# Altium project EE534 - Development Kit Basic.PrjPcb
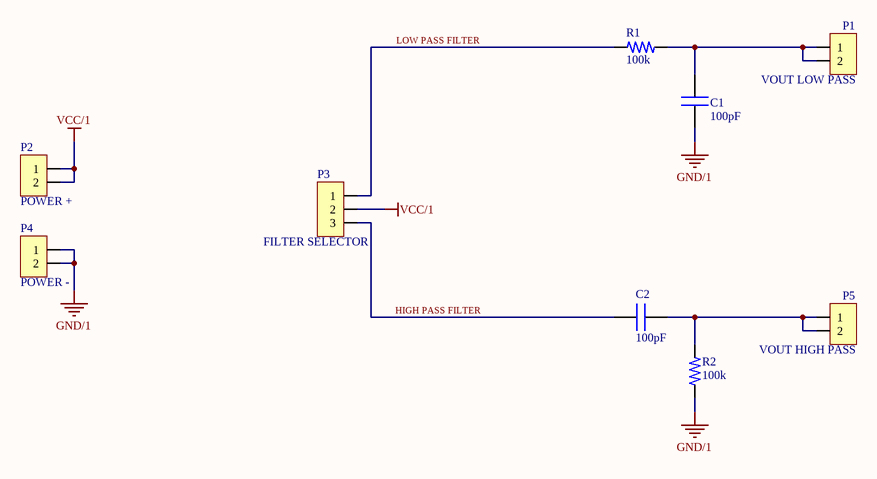
[diagram p0: Experiment 1 0.0.0.SchDoc]
5 sheets, 89 parts. Net scope: global (net labels, ports and power ports of the same name join across sheets).
Board file: All-in-One 0.0.0.PcbDoc
Sheets:
  Experiment 1 0.0.0.SchDoc
  Experiment 2 0.0.0.SchDoc
  Experiment 3 0.0.0.SchDoc
  Experiment 4 0.0.0.SchDoc
  Experiment 5 0.0.0.SchDoc

## Sheet Experiment 1 0.0.0.SchDoc
size A4; Organization: Altium Limited; Address1: L3, 12a Rodborough Rd; Address2: Frenchs Forest; Address3: NSW; Address4: Australia 2086; DocumentNumber: 1; SheetNumber: 1; SheetTotal: 5

### Parts
C1  100pF  [CAP-H5]
C2  100pF  [CAP-H5]
P1  VOUT LOW PASS  [PINHD-1X02 ONCE]
P2  POWER +  [PINHD-1X02 ONCE]
P3  FILTER SELECTOR  [PINHD-1X03]
P4  POWER -  [PINHD-1X02 ONCE]
P5  VOUT HIGH PASS  [PINHD-1X02 ONCE]
R1  100k  [R Axial 0.25]
R2  100k  [R Axial 0.25]

### Nets
GND/1: C1.2 P4.1 P4.2 R2.1
VCC/1: P2.1 P2.2 P3.2
NetC1_1: C1.1 P1.1 P1.2 R1.2
NetC2_1: C2.1 P3.3
NetC2_2: C2.2 P5.1 P5.2 R2.2
NetP3_1: P3.1 R1.1

### Notes on the sheet
- LOW PASS FILTER
- HIGH PASS FILTER
- Elivelton Santos
- https://github.com/eliveltonpsantos
- Project:
- Sheet:
- Date:
- Time:
- Sheet
- of
- File:

### Library data of the parts
C1 C2 = K101K10X7RF5UH5: CAP CER 100PF 50V X7R RADIAL; Manufacturer: Vishay BC Components; Tolerance: ±10%; Category: Capacitors; Manufacturer Part Number: K101K10X7RF5UH5; Package / Case: 0.142" L x 0.091" W (3.60mm x 2.30mm); Capacitance: 100pF; Voltage: 50V; Supplier 1: Digi-Key; Supplier Part Number 1: BC2657CT-ND
P1 P2 P4 P5 = PIN HEADER 1X02 ONCE: CONN HEADER 2POS .100" STR TIN; Manufacturer: Molex, LLC; Manufacturer Part Number: 0901200122; Category: Connectors; Supplier 1: Digi-Key; Supplier Part Number 1: WM8072-ND
P3 = PIN HEADER 1X03: CONN HEADER 3POS .100" STR TIN; Manufacturer: Molex, LLC; Manufacturer Part Number: 0901200123; Category: Connectors; Supplier 1: Digi-Key; Supplier Part Number 1: WM8073-ND
R1 R2 = CFR-25JB-52-100K: RES 100K OHM 1/4W 5% AXIAL; Manufacturer: Yageo; Power (Watts): 0.25W, 1/4W; Resistance (Ohms): 10k; Category: Resistors; Manufacturer Part Number: CFR-25JB-52-100K; Package / Case: Axial; Tolerance: ±5%; Supplier 1: Digi-Key; Supplier Part Number 1: 100KQBK-ND

## Sheet Experiment 2 0.0.0.SchDoc
size A4; Organization: Altium Limited; Address1: L3, 12a Rodborough Rd; Address2: Frenchs Forest; Address3: NSW; Address4: Australia 2086; DocumentNumber: 2; SheetNumber: 2; SheetTotal: 5
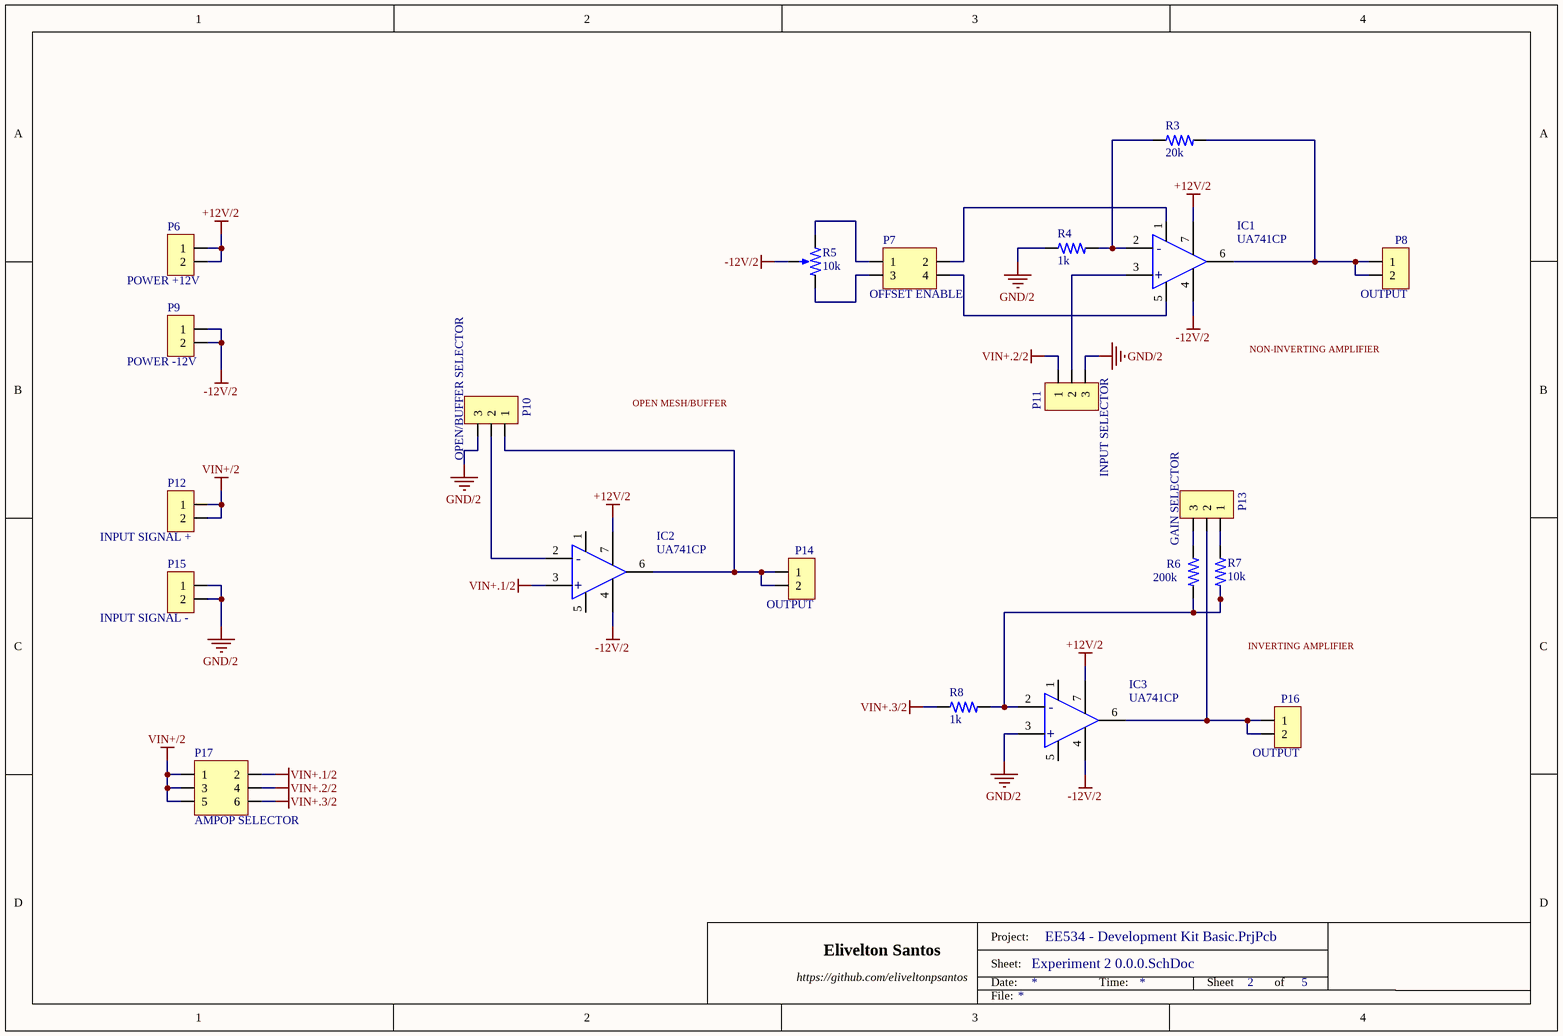
[diagram p1: Experiment 2 0.0.0.SchDoc]

### Parts
IC1  UA741CP  [DIP-8]
IC2  UA741CP  [DIP-8]
IC3  UA741CP  [DIP-8]
P6  POWER +12V  [PINHD-1X02 ONCE]
P7  OFFSET ENABLE  [PINHD-2X02]
P8  OUTPUT  [PINHD-1X02 ONCE]
P9  POWER -12V  [PINHD-1X02 ONCE]
P10  OPEN/BUFFER SELECTOR  [PINHD-1X03]
P11  INPUT SELECTOR  [PINHD-1X03]
P12  INPUT SIGNAL +  [PINHD-1X02 ONCE]
P13  GAIN SELECTOR  [PINHD-1X03]
P14  OUTPUT  [PINHD-1X02 ONCE]
P15  INPUT SIGNAL -  [PINHD-1X02 ONCE]
P16  OUTPUT  [PINHD-1X02 ONCE]
P17  AMPOP SELECTOR  [PINHD-2X03]
R3  20k  [R Axial 0.25]
R4  1k  [R Axial 0.25]
R5  10k  [PV36W]
R6  200k  [R Axial 0.25]
R7  10k  [R Axial 0.25]
R8  1k  [R Axial 0.25]

### Nets
+12V/2: IC1.7(VCC+) IC2.7(VCC+) IC3.7(VCC+) P6.1 P6.2
-12V/2: IC1.4(VCC-) IC2.4(VCC-) IC3.4(VCC-) P9.1 P9.2 R5.2
GND/2: IC3.3(+) P10.3 P11.3 P15.1 P15.2 R4.1
VIN+.1/2: IC2.3(+) P17.2
VIN+.2/2: P11.1 P17.4
VIN+.3/2: P17.6 R8.1
VIN+/2: P12.1 P12.2 P17.1 P17.3 P17.5
NetIC1_1: IC1.1(OFFSET1) P7.2
NetIC1_2: IC1.2(-) R3.1 R4.2
NetIC1_3: IC1.3(+) P11.2
NetIC1_5: IC1.5(OFFSET2) P7.4
NetIC1_6: IC1.6(OUTPUT) P8.1 P8.2 R3.2
NetIC2_2: IC2.2(-) P10.2
NetIC2_6: IC2.6(OUTPUT) P10.1 P14.1 P14.2
NetIC3_2: IC3.2(-) R6.1 R7.2 R8.2
NetIC3_6: IC3.6(OUTPUT) P13.2 P16.1 P16.2
NetP7_1: P7.1 R5.1
NetP7_3: P7.3 R5.3
NetP13_1: P13.1 R7.1
NetP13_3: P13.3 R6.2

Not connected (* = marked no-connect by the designer): IC2 1(OFFSET1) 5(OFFSET2); IC3 1(OFFSET1) 5(OFFSET2)

### Notes on the sheet
- NON-INVERTING AMPLIFIER
- OPEN MESH/BUFFER
- INVERTING AMPLIFIER
- Elivelton Santos
- https://github.com/eliveltonpsantos
- Project:
- Sheet:
- Date:
- Time:
- Sheet
- of
- File:

### Library data of the parts
IC1-IC3 = UA741CP: IC OPAMP GP 1MHZ 8DIP; Manufacturer: Texas Instruments; Category: ICs; Manufacturer Part Number: UA741CP; Package / Case: 8-PDIP; Supplier 1: Digi-Key; Supplier Part Number 1: 296-11107-5-ND
P6 P8 P9 P12 P14-P16 = PIN HEADER 1X02 ONCE: as P1 on sheet Experiment 1 0.0.0; Category: Connectors; Supplier 1: Digi-Key; Supplier Part Number 1: WM8072-ND
P7 = PIN HEADER 2X02: CONN HEADER 4POS .100" STR TIN; Manufacturer: Molex, LLC; Manufacturer Part Number: 0901310122; Category: Connectors; Supplier 1: Digi-Key; Supplier Part Number 1: WM8120-ND
P10 P11 P13 = PIN HEADER 1X03: as P3 on sheet Experiment 1 0.0.0; Category: Connectors; Supplier 1: Digi-Key; Supplier Part Number 1: WM8073-ND
P17 = PIN HEADER 2X03: CONN HEADER 6POS .100" STR TIN; Manufacturer: Molex, LLC; Manufacturer Part Number: 0901310123; Category: Connectors; Supplier 1: Digi-Key; Supplier Part Number 1: WM8121-ND
R3 = CFR-25JB-52-20K: RES 20K OHM 1/4W 5% AXIAL; Manufacturer: Yageo; Power (Watts): 0.25W, 1/4W; Category: Resistors; Manufacturer Part Number: CFR-25JB-52-20K; Package / Case: Axial; Resistance (Ohms): 20k; Tolerance: ±5%; Supplier 1: Digi-Key; Supplier Part Number 1: 20KQBK-ND
R4 R8 = CFR-25JB-52-1K: RES 1K OHM 1/4W 5% AXIAL; Manufacturer: Yageo; Power (Watts): 0.25W, 1/4W; Category: Resistors; Manufacturer Part Number: CFR-25JB-52-1K; Package / Case: Axial; Resistance (Ohms): 1k; Tolerance: ±5%; Supplier 1: Digi-Key; Supplier Part Number 1: 1.0KQBK-ND
R5 = PV36W103C01B00: TRIMMER 10K OHM 0.5W TH; Manufacturer: Bourns Inc.; Power (Watts): 0.5W, 1/2W; Tolerance: ±10%; Number of Turns: 25; Adjustment Type: Top Adjustment; Category: Resistors; Manufacturer Part Number: PV36W103C01B00; Resistance (Ohms): 10k; Supplier 1: Digi-Key; Supplier Part Number 1: 490-2875-ND
R6 = CFR-25JB-52-200K: RES 200K OHM 1/4W 5% AXIAL; Manufacturer: Yageo; Power (Watts): 0.25W, 1/4W; Category: Resistors; Manufacturer Part Number: CFR-25JB-52-200K; Package / Case: Axial; Resistance (Ohms): 200k; Tolerance: ±5%; Supplier 1: Digi-Key; Supplier Part Number 1: 200KQBK-ND
R7 = CFR-25JB-52-10K: RES 10K OHM 1/4W 5% AXIAL; Manufacturer: Yageo; Power (Watts): 0.25W, 1/4W; Category: Resistors; Manufacturer Part Number: CFR-25JB-52-10K; Package / Case: Axial; Resistance (Ohms): 10k; Tolerance: ±5%; Supplier 1: Digi-Key; Supplier Part Number 1: 10KQBK-ND

## Sheet Experiment 3 0.0.0.SchDoc
size A4; Organization: Altium Limited; Address1: L3, 12a Rodborough Rd; Address2: Frenchs Forest; Address3: NSW; Address4: Australia 2086; DocumentNumber: 3; SheetNumber: 3; SheetTotal: 5
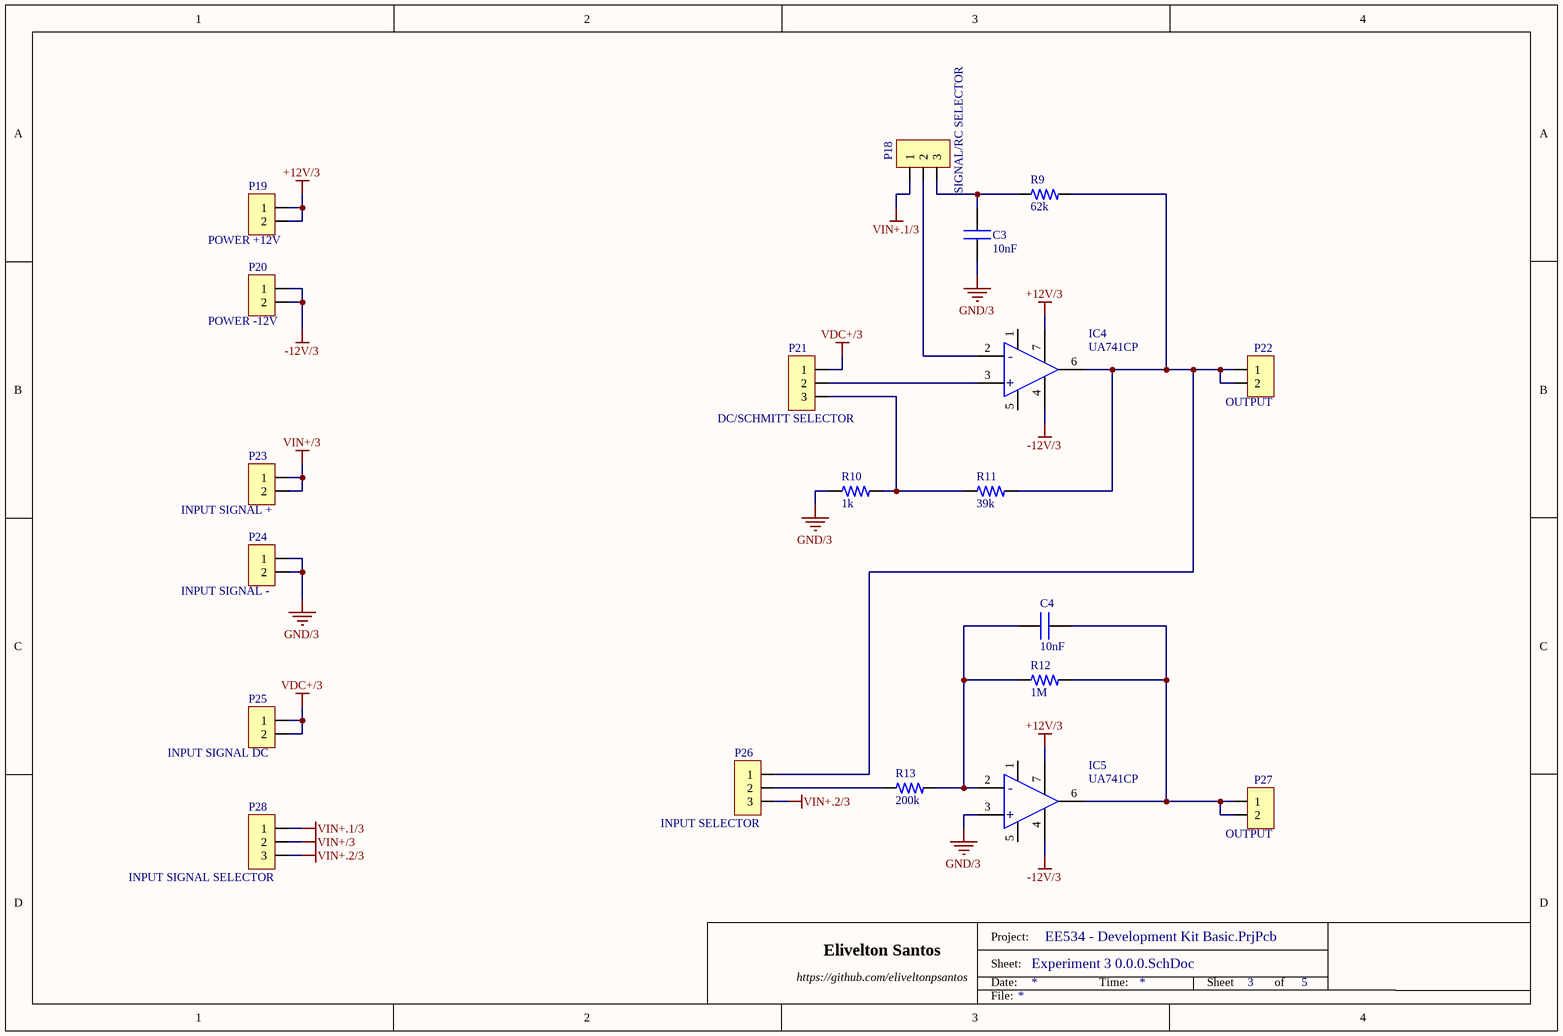
[diagram p2: Experiment 3 0.0.0.SchDoc]

### Parts
C3  10nF  [CAP-H5]
C4  10nF  [CAP-H5]
IC4  UA741CP  [DIP-8]
IC5  UA741CP  [DIP-8]
P18  SIGNAL/RC SELECTOR  [PINHD-1X03]
P19  POWER +12V  [PINHD-1X02 ONCE]
P20  POWER -12V  [PINHD-1X02 ONCE]
P21  DC/SCHMITT SELECTOR  [PINHD-1X03]
P22  OUTPUT  [PINHD-1X02 ONCE]
P23  INPUT SIGNAL +  [PINHD-1X02 ONCE]
P24  INPUT SIGNAL -  [PINHD-1X02 ONCE]
P25  INPUT SIGNAL DC  [PINHD-1X02 ONCE]
P26  INPUT SELECTOR  [PINHD-1X03]
P27  OUTPUT  [PINHD-1X02 ONCE]
P28  INPUT SIGNAL SELECTOR  [PINHD-1X03]
R9  62k  [R Axial 0.25]
R10  1k  [R Axial 0.25]
R11  39k  [R Axial 0.25]
R12  1M  [R Axial 0.25]
R13  200k  [R Axial 0.25]

### Nets
+12V/3: IC4.7(VCC+) IC5.7(VCC+) P19.1 P19.2
-12V/3: IC4.4(VCC-) IC5.4(VCC-) P20.1 P20.2
GND/3: C3.1 IC5.3(+) P24.1 P24.2 R10.1
VDC+/3: P21.1 P25.1 P25.2
VIN+.1/3: P18.1 P28.1
VIN+.2/3: P26.3 P28.3
VIN+/3: P23.1 P23.2 P28.2
NetC3_2: C3.2 P18.3 R9.1
NetC4_1: C4.1 IC5.6(OUTPUT) P27.1 P27.2 R12.2
NetC4_2: C4.2 IC5.2(-) R12.1 R13.2
NetIC4_2: IC4.2(-) P18.2
NetIC4_3: IC4.3(+) P21.2
NetIC4_6: IC4.6(OUTPUT) P22.1 P22.2 P26.1 R9.2 R11.2
NetP21_3: P21.3 R10.2 R11.1
NetP26_2: P26.2 R13.1

Not connected (* = marked no-connect by the designer): IC4 1(OFFSET1) 5(OFFSET2); IC5 1(OFFSET1) 5(OFFSET2)

### Notes on the sheet
- Elivelton Santos
- https://github.com/eliveltonpsantos
- Project:
- Sheet:
- Date:
- Time:
- Sheet
- of
- File:

### Library data of the parts
C3 C4 = K103K10X7RF5UH5: CAP CER 10000PF 50V X7R RADIAL; Manufacturer: Vishay BC Components; Manufacturer Part Number: K101K10X7RF5UH5; Tolerance: ±10%; Category: Capacitors; Package / Case: 0.142" L x 0.091" W (3.60mm x 2.30mm); Capacitance: 10nF; Voltage: 50V; Supplier 1: Digi-Key; Supplier Part Number 1: BC2662CT-ND
IC4 IC5 = UA741CP: as IC1 on sheet Experiment 2 0.0.0; Category: ICs; Manufacturer Part Number: UA741CP; Package / Case: 8-PDIP; Supplier 1: Digi-Key; Supplier Part Number 1: 296-11107-5-ND
P18 P21 P26 P28 = PIN HEADER 1X03: as P3 on sheet Experiment 1 0.0.0; Category: Connectors; Supplier 1: Digi-Key; Supplier Part Number 1: WM8073-ND
P19 P20 P22-P25 P27 = PIN HEADER 1X02 ONCE: as P1 on sheet Experiment 1 0.0.0; Category: Connectors; Supplier 1: Digi-Key; Supplier Part Number 1: WM8072-ND
R9 = CFR-25JB-52-62K: RES 62K OHM 1/4W 5% AXIAL; Manufacturer: Yageo; Power (Watts): 0.25W, 1/4W; Category: Resistors; Manufacturer Part Number: CFR-25JB-52-62K; Package / Case: Axial; Resistance (Ohms): 62k; Tolerance: ±5%; Supplier 1: Digi-Key; Supplier Part Number 1: 62KQBK-ND
R10 = CFR-25JB-52-1K: as R4 on sheet Experiment 2 0.0.0; Category: Resistors; Manufacturer Part Number: CFR-25JB-52-1K; Package / Case: Axial; Resistance (Ohms): 1k; Tolerance: ±5%; Supplier 1: Digi-Key; Supplier Part Number 1: 1.0KQBK-ND
R11 = CFR-25JB-52-39K: RES 39K OHM 1/4W 5% AXIAL; Manufacturer: Yageo; Power (Watts): 0.25W, 1/4W; Category: Resistors; Manufacturer Part Number: CFR-25JB-52-39K; Package / Case: Axial; Resistance (Ohms): 39k; Tolerance: ±5%; Supplier 1: Digi-Key; Supplier Part Number 1: 39KQBK-ND
R12 = CFR-25JB-52-1M: RES 1M OHM 1/4W 5% AXIAL; Manufacturer: Yageo; Power (Watts): 0.25W, 1/4W; Category: Resistors; Manufacturer Part Number: CFR-25JB-52-1M; Package / Case: Axial; Resistance (Ohms): 1M; Tolerance: ±5%; Supplier 1: Digi-Key; Supplier Part Number 1: 1.0MQBK-ND
R13 = CFR-25JB-52-200K: as R6 on sheet Experiment 2 0.0.0; Category: Resistors; Manufacturer Part Number: CFR-25JB-52-200K; Package / Case: Axial; Resistance (Ohms): 200k; Tolerance: ±5%; Supplier 1: Digi-Key; Supplier Part Number 1: 200KQBK-ND

## Sheet Experiment 4 0.0.0.SchDoc
size A4; Organization: Altium Limited; Address1: L3, 12a Rodborough Rd; Address2: Frenchs Forest; Address3: NSW; Address4: Australia 2086; DocumentNumber: 4; SheetNumber: 4; SheetTotal: 5
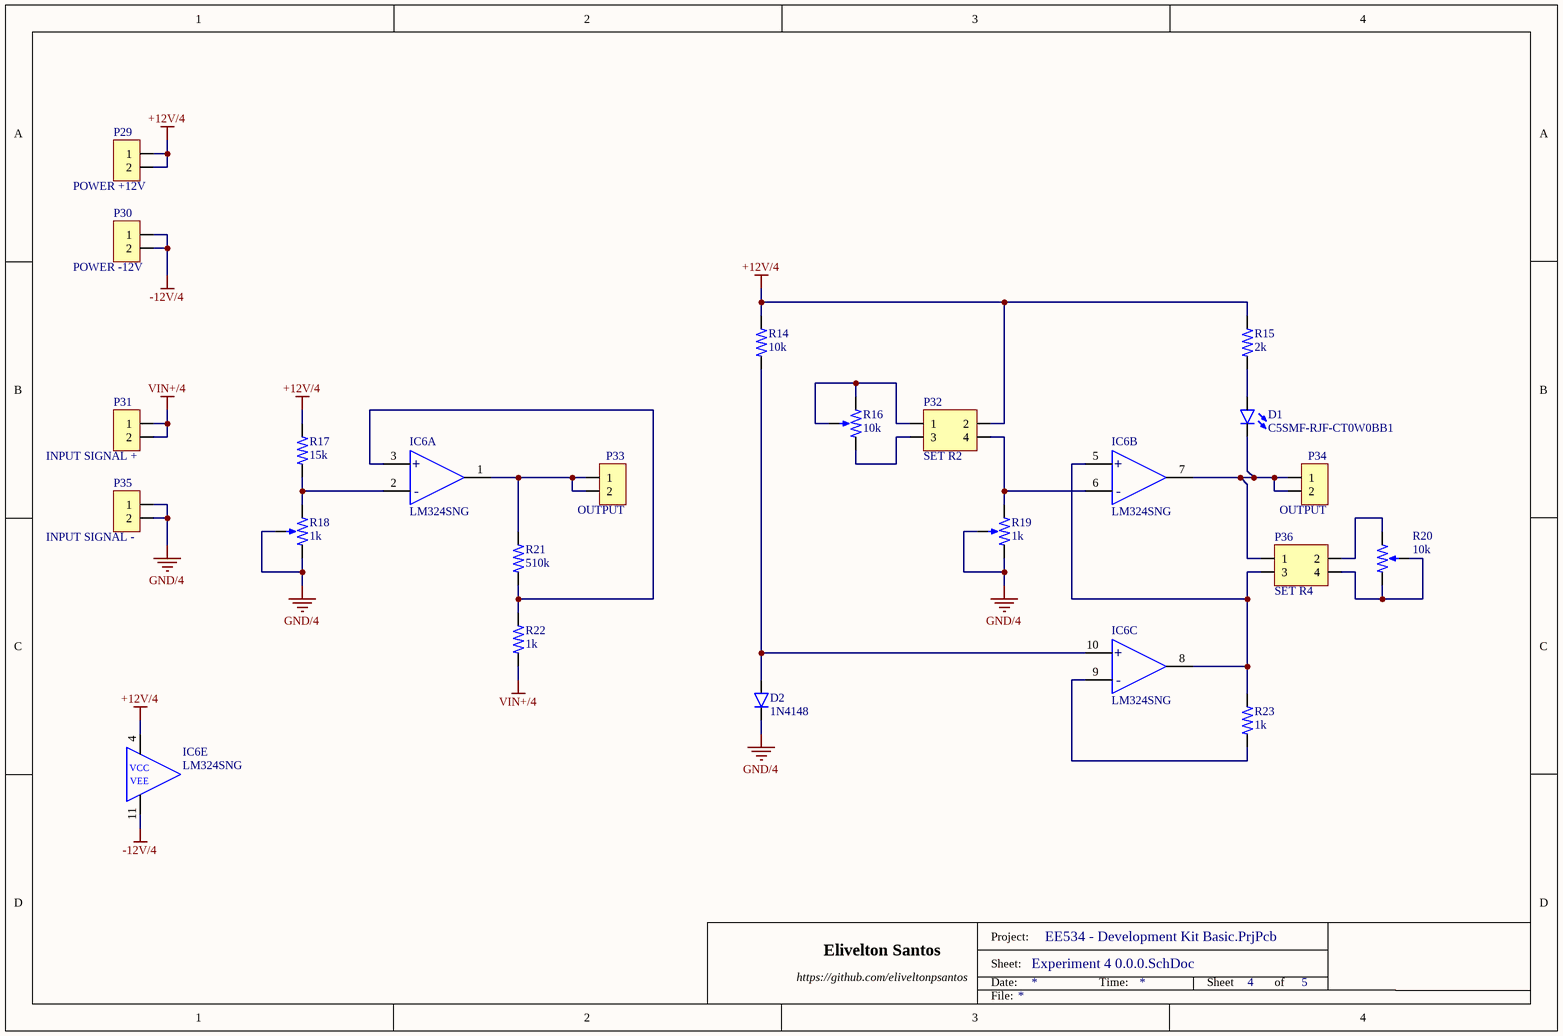
[diagram p3: Experiment 4 0.0.0.SchDoc]

### Parts
D1  C5SMF-RJF-CT0W0BB1  [LED-5MM]
D2  1N4148  [DO35-10]
IC6  LM324SNG  [DIP-14]  (parts A,B,C,E of 5)
P29  POWER +12V  [PINHD-1X02 ONCE]
P30  POWER -12V  [PINHD-1X02 ONCE]
P31  INPUT SIGNAL +  [PINHD-1X02 ONCE]
P32  SET R2  [PINHD-2X02]
P33  OUTPUT  [PINHD-1X02 ONCE]
P34  OUTPUT  [PINHD-1X02 ONCE]
P35  INPUT SIGNAL -  [PINHD-1X02 ONCE]
P36  SET R4  [PINHD-2X02]
R14  10k  [R Axial 0.25]
R15  2k  [R Axial 0.25]
R16  10k  [PV36W]
R17  15k  [R Axial 0.25]
R18  1k  [PV36W]
R19  1k  [PV36W]
R20  10k  [PV36W]
R21  510k  [R Axial 0.25]
R22  1k  [R Axial 0.25]
R23  1k  [R Axial 0.25]

### Nets
+12V/4: IC6.4(VCC) P29.1 P29.2 P32.2 R14.2 R15.2 R17.2
-12V/4: IC6.11(VEE) P30.1 P30.2
GND/4: D2.C(Cathode) P35.1 P35.2 R18.2 R18.3 R19.2 R19.3
VIN+/4: P31.1 P31.2 R22.1
NetD1_1: D1.1(Anode) R15.1
NetD1_2: D1.2(Cathode) IC6.7(OUTPUT_2) P34.1 P34.2 P36.1
NetD2_A: D2.A(Anode) IC6.10(INPUT_+_3) R14.1
NetIC6_1: IC6.1(OUTPUT_1) P33.1 P33.2 R21.2
NetIC6_2: IC6.2(INPUT_-_1) R17.1 R18.1
NetIC6_3: IC6.3(INPUT_+_1) R21.1 R22.2
NetIC6_5: IC6.5(INPUT_+_2) IC6.8(OUTPUT_3) P36.3 R23.2
NetIC6_6: IC6.6(INPUT_-_2) P32.4 R19.1
NetIC6_9: IC6.9(INPUT_-_3) R23.1
NetP32_1: P32.1 R16.1 R16.2
NetP32_3: P32.3 R16.3
NetP36_2: P36.2 R20.3
NetP36_4: P36.4 R20.1 R20.2

### Notes on the sheet
- Elivelton Santos
- https://github.com/eliveltonpsantos
- Project:
- Sheet:
- Date:
- Time:
- Sheet
- of
- File:
- (in symbol LM324SNG, part A) +; -
- (in symbol LM324SNG, part B) +; -
- (in symbol LM324SNG, part C) +; -

### Library data of the parts
D1 = C5SMF-RJF-CT0W0BB1: LED RED CLEAR 5MM OVAL T/H; Manufacturer: Cree Inc.; Category: Optoelectronics; Manufacturer Part Number: C5SMF-RJF-CT0W0BB1; Package / Case: 5mm Oval; Color: Red; Supplier 1: Digi-Key; Supplier Part Number 1: C5SMF-RJF-CT0W0BB1-ND
D2 = 1N4148: DIODE GEN PURP 100V 200MA DO35; Manufacturer: Fairchild Semiconductor; Category: Diodes; Manufacturer Part Number: 1N4148; Package / Case: DO-35; Reverse Voltage: 100V; Forward Current: 200mA; Supplier 1: Digi-Key; Supplier Part Number 1: 1N4148FS-ND
IC6 = LM324SNG: IC OP AMP 4CH 14DIP; Manufacturer: ON Semiconductor; Category: ICs; Manufacturer Part Number: LM324SNG; Package / Case: 14-PDIP; Supplier 1: Digi-Key; Supplier Part Number 1: LM324SNGOS-ND
P29-P31 P33-P35 = PIN HEADER 1X02 ONCE: as P1 on sheet Experiment 1 0.0.0; Category: Connectors; Supplier 1: Digi-Key; Supplier Part Number 1: WM8072-ND
P32 P36 = PIN HEADER 2X02: as P7 on sheet Experiment 2 0.0.0; Category: Connectors; Supplier 1: Digi-Key; Supplier Part Number 1: WM8120-ND
R14 = CFR-25JB-52-10K: as R7 on sheet Experiment 2 0.0.0; Category: Resistors; Manufacturer Part Number: CFR-25JB-52-10K; Package / Case: Axial; Resistance (Ohms): 10k; Tolerance: ±5%; Supplier 1: Digi-Key; Supplier Part Number 1: 10KQBK-ND
R15 = CFR-25JB-52-2K: RES 2K OHM 1/4W 5% AXIAL; Manufacturer: Yageo; Power (Watts): 0.25W, 1/4W; Category: Resistors; Manufacturer Part Number: CFR-25JB-52-2K; Package / Case: Axial; Resistance (Ohms): 2k; Tolerance: ±5%; Supplier 1: Digi-Key; Supplier Part Number 1: 2.0KQBK-ND
R16 R20 = PV36W103C01B00: as R5 on sheet Experiment 2 0.0.0; Category: Resistors; Manufacturer Part Number: PV36W103C01B00; Resistance (Ohms): 10k; Supplier 1: Digi-Key; Supplier Part Number 1: 490-2875-ND
R17 = CFR-25JB-52-15K: RES 15K OHM 1/4W 5% AXIAL; Manufacturer: Yageo; Power (Watts): 0.25W, 1/4W; Category: Resistors; Manufacturer Part Number: CFR-25JB-52-15K; Package / Case: Axial; Resistance (Ohms): 15k; Tolerance: ±5%; Supplier 1: Digi-Key; Supplier Part Number 1: 15KQBK-ND
R18 R19 = PV36W102C01B00: TRIMMER 1K OHM 0.5W TH; Manufacturer: Bourns Inc.; Power (Watts): 0.5W, 1/2W; Tolerance: ±10%; Number of Turns: 25; Adjustment Type: Top Adjustment; Category: Resistors; Manufacturer Part Number: PV36W102C01B00; Resistance (Ohms): 1k; Supplier 1: Digi-Key; Supplier Part Number 1: 490-2874-ND
R21 = CFR-25JB-52-510K: RES 510K OHM 1/4W 5% AXIAL; Manufacturer: Yageo; Power (Watts): 0.25W, 1/4W; Category: Resistors; Manufacturer Part Number: CFR-25JB-52-510K; Package / Case: Axial; Resistance (Ohms): 510k; Tolerance: ±5%; Supplier 1: Digi-Key; Supplier Part Number 1: 510KQBK-ND
R22 R23 = CFR-25JB-52-1K: as R4 on sheet Experiment 2 0.0.0; Category: Resistors; Manufacturer Part Number: CFR-25JB-52-1K; Package / Case: Axial; Resistance (Ohms): 1k; Tolerance: ±5%; Supplier 1: Digi-Key; Supplier Part Number 1: 1.0KQBK-ND

## Sheet Experiment 5 0.0.0.SchDoc
size A4; Organization: Altium Limited; Address1: L3, 12a Rodborough Rd; Address2: Frenchs Forest; Address3: NSW; Address4: Australia 2086; DocumentNumber: 5; SheetNumber: 5; SheetTotal: 5
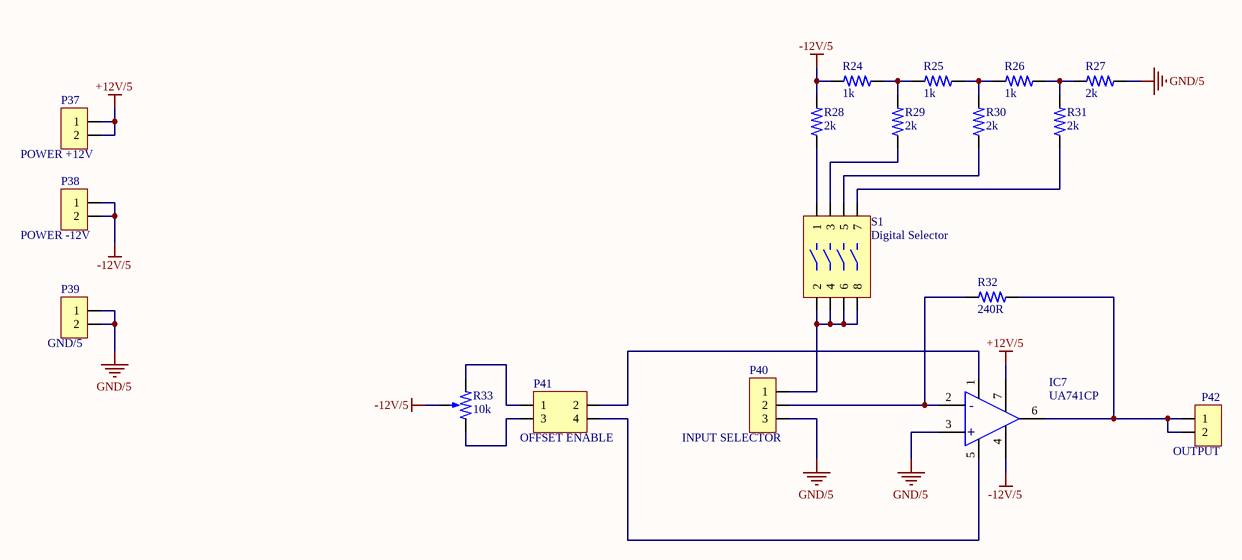
[diagram p4: Experiment 5 0.0.0.SchDoc]

### Parts
IC7  UA741CP  [DIP-8]
P37  POWER +12V  [PINHD-1X02 ONCE]
P38  POWER -12V  [PINHD-1X02 ONCE]
P39  GND/5  [PINHD-1X02 ONCE]
P40  INPUT SELECTOR  [PINHD-1X03]
P41  OFFSET ENABLE  [PINHD-2X02]
P42  OUTPUT  [PINHD-1X02 ONCE]
R24  1k  [R Axial 0.25]
R25  1k  [R Axial 0.25]
R26  1k  [R Axial 0.25]
R27  2k  [R Axial 0.25]
R28  2k  [R Axial 0.25]
R29  2k  [R Axial 0.25]
R30  2k  [R Axial 0.25]
R31  2k  [R Axial 0.25]
R32  240R  [R Axial 0.25]
R33  10k  [PV36W]
S1  Digital Selector  [DIP-206-4S]

### Nets
+12V/5: IC7.7(VCC+) P37.1 P37.2
-12V/5: IC7.4(VCC-) P38.1 P38.2 R24.1 R28.2 R33.2
GND/5: IC7.3(+) P39.1 P39.2 P40.3 R27.2
NetIC7_1: IC7.1(OFFSET1) P41.2
NetIC7_2: IC7.2(-) P40.2 R32.1
NetIC7_5: IC7.5(OFFSET2) P41.4
NetIC7_6: IC7.6(OUTPUT) P42.1 P42.2 R32.2
NetP40_1: P40.1 S1.2 S1.4 S1.6 S1.8
NetP41_1: P41.1 R33.1
NetP41_3: P41.3 R33.3
NetR24_2: R24.2 R25.1 R29.2
NetR25_2: R25.2 R26.1 R30.2
NetR26_2: R26.2 R27.1 R31.2
NetR28_1: R28.1 S1.1
NetR29_1: R29.1 S1.3
NetR30_1: R30.1 S1.5
NetR31_1: R31.1 S1.7

### Notes on the sheet
- Elivelton Santos
- https://github.com/eliveltonpsantos
- Project:
- Sheet:
- Date:
- Time:
- Sheet
- of
- File:

### Library data of the parts
IC7 = UA741CP: as IC1 on sheet Experiment 2 0.0.0; Category: ICs; Manufacturer Part Number: UA741CP; Package / Case: 8-PDIP; Supplier 1: Digi-Key; Supplier Part Number 1: 296-11107-5-ND
P37-P39 P42 = PIN HEADER 1X02 ONCE: as P1 on sheet Experiment 1 0.0.0; Category: Connectors; Supplier 1: Digi-Key; Supplier Part Number 1: WM8072-ND
P40 = PIN HEADER 1X03: as P3 on sheet Experiment 1 0.0.0; Category: Connectors; Supplier 1: Digi-Key; Supplier Part Number 1: WM8073-ND
P41 = PIN HEADER 2X02: as P7 on sheet Experiment 2 0.0.0; Category: Connectors; Supplier 1: Digi-Key; Supplier Part Number 1: WM8120-ND
R24-R26 = CFR-25JB-52-1K: as R4 on sheet Experiment 2 0.0.0; Category: Resistors; Manufacturer Part Number: CFR-25JB-52-1K; Package / Case: Axial; Resistance (Ohms): 1k; Tolerance: ±5%; Supplier 1: Digi-Key; Supplier Part Number 1: 1.0KQBK-ND
R27-R31 = CFR-25JB-52-2K: as R15 on sheet Experiment 4 0.0.0; Category: Resistors; Manufacturer Part Number: CFR-25JB-52-2K; Package / Case: Axial; Resistance (Ohms): 2k; Tolerance: ±5%; Supplier 1: Digi-Key; Supplier Part Number 1: 2.0KQBK-ND
R32 = CFR-25JB-52-240R: RES 240 OHM 1/4W 5% AXIAL; Manufacturer: Yageo; Power (Watts): 0.25W, 1/4W; Resistance (Ohms): 250; Category: Resistors; Manufacturer Part Number: CFR-25JB-52-240R; Package / Case: Axial; Tolerance: ±5%; Supplier 1: Digi-Key; Supplier Part Number 1: 240QBK-ND
R33 = PV36W103C01B00: as R5 on sheet Experiment 2 0.0.0; Category: Resistors; Manufacturer Part Number: PV36W103C01B00; Resistance (Ohms): 10k; Supplier 1: Digi-Key; Supplier Part Number 1: 490-2875-ND
S1 = 206-4: SWITCH SLIDE DIP SPST 50MA 24V; Manufacturer: CTS Electrocomponents; Pitch: 0.100" (2.54mm); Number of Positions: 4; Category: Switches; Manufacturer Part Number: 206-4; Supplier 1: Digi-Key; Supplier Part Number 1: CT2064-ND